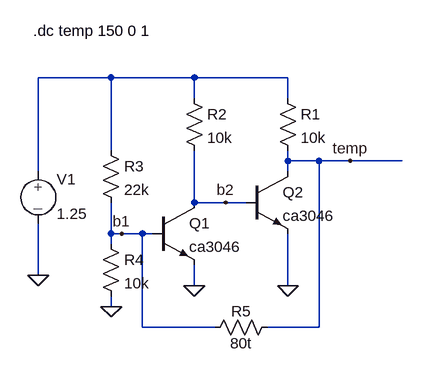
[diagram p0: schematic temp_shu_down.asc]
temp_shu_down.asc, the LTspice schematic file:
Version 4
SHEET 1 880 680
WIRE 128 -32 16 -32
WIRE 256 -32 128 -32
WIRE 400 -32 256 -32
WIRE 256 0 256 -32
WIRE 400 0 400 -32
WIRE 128 80 128 -32
WIRE 400 96 400 80
WIRE 448 96 400 96
WIRE 496 96 448 96
WIRE 576 96 496 96
WIRE 16 112 16 -32
WIRE 400 112 400 96
WIRE 256 160 256 80
WIRE 304 160 256 160
WIRE 336 160 304 160
WIRE 128 208 128 160
WIRE 144 208 128 208
WIRE 176 208 144 208
WIRE 192 208 176 208
WIRE 128 224 128 208
WIRE 16 272 16 192
WIRE 256 288 256 256
WIRE 400 288 400 208
WIRE 128 320 128 304
WIRE 176 352 176 208
WIRE 288 352 176 352
WIRE 448 352 448 96
WIRE 448 352 368 352
FLAG 256 288 0
FLAG 400 288 0
FLAG 16 272 0
FLAG 496 96 temp
FLAG 128 320 0
FLAG 144 208 b1
FLAG 304 160 b2
SYMBOL EIT_Semiconductors\\npn 192 160 R0
SYMATTR InstName Q1
SYMATTR Value ca3046
SYMBOL EIT_Semiconductors\\npn 336 112 R0
SYMATTR InstName Q2
SYMATTR Value ca3046
SYMBOL res 384 -16 R0
SYMATTR InstName R1
SYMATTR Value 10k
SYMBOL res 240 -16 R0
SYMATTR InstName R2
SYMATTR Value 10k
SYMBOL res 112 64 R0
SYMATTR InstName R3
SYMATTR Value 22k
SYMBOL res 112 208 R0
SYMATTR InstName R4
SYMATTR Value 10k
SYMBOL source-V 16 96 R0
SYMATTR InstName V1
SYMATTR Value 1.25
SYMBOL res 384 336 R90
WINDOW 0 7 56 VBottom 2
WINDOW 3 25 56 VTop 2
SYMATTR InstName R5
SYMATTR Value 80t
TEXT 8 -104 Left 2 !.dc temp 150 0 1

The netlist it stands for:
* temp_shu_down.asc
Q1 b2 b1 0 0 ca3046
Q2 temp b2 0 0 ca3046
R1 N001 temp 10k
R2 N001 b2 10k
R3 N001 b1 22k
R4 b1 0 10k
V1 N001 0 1.25
R5 temp b1 80t
.model NPN NPN
.model PNP PNP
.lib standard.bjt
.dc temp 150 0 1
.backanno
.end